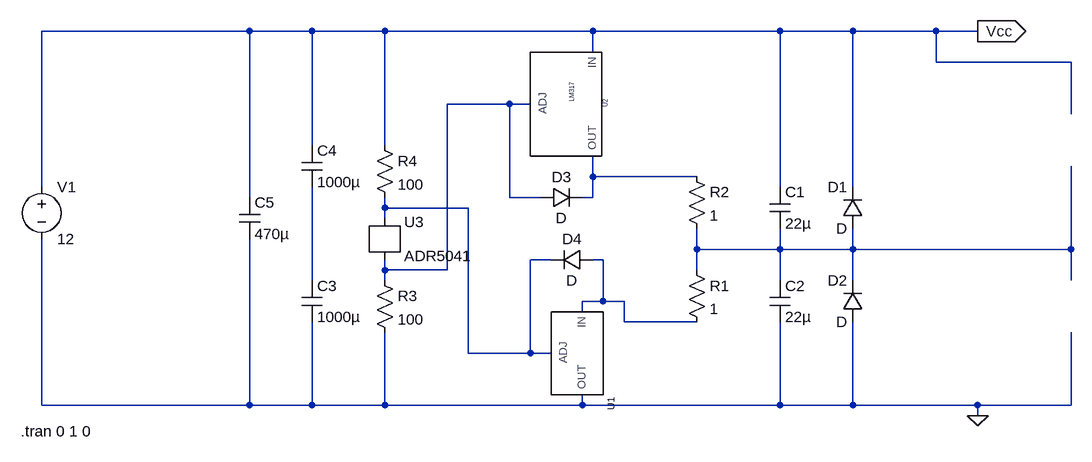
[diagram p0: schematic Draft1.asc]
Draft1.asc, the LTspice schematic file:
Version 4
SHEET 1 880 680
WIRE -1152 -192 -1472 -192
WIRE -1056 -192 -1152 -192
WIRE -944 -192 -1056 -192
WIRE -624 -192 -944 -192
WIRE -336 -192 -624 -192
WIRE -224 -192 -336 -192
WIRE -96 -192 -224 -192
WIRE -32 -192 -96 -192
WIRE -624 -160 -624 -192
WIRE -96 -144 -96 -192
WIRE 112 -144 -96 -144
WIRE -752 -80 -848 -80
WIRE -720 -80 -752 -80
WIRE 112 -64 112 -144
WIRE -1056 -16 -1056 -192
WIRE -944 -16 -944 -192
WIRE -624 32 -624 0
WIRE -464 32 -624 32
WIRE -1472 48 -1472 -192
WIRE -336 48 -336 -192
WIRE -224 48 -224 -192
WIRE -1152 64 -1152 -192
WIRE -752 64 -752 -80
WIRE -704 64 -752 64
WIRE -624 64 -624 32
WIRE -624 64 -640 64
WIRE -944 80 -944 64
WIRE -816 80 -944 80
WIRE -944 96 -944 80
WIRE -464 144 -464 112
WIRE -336 144 -336 112
WIRE -336 144 -464 144
WIRE -224 144 -224 112
WIRE -224 144 -336 144
WIRE 112 144 112 16
WIRE 112 144 -224 144
WIRE -688 160 -720 160
WIRE -608 160 -624 160
WIRE -944 176 -944 160
WIRE -848 176 -848 -80
WIRE -848 176 -944 176
WIRE -464 176 -464 144
WIRE -1056 192 -1056 48
WIRE -944 192 -944 176
WIRE -336 192 -336 144
WIRE -224 192 -224 144
WIRE 112 192 112 144
WIRE -608 224 -608 160
WIRE -608 224 -640 224
WIRE -576 224 -608 224
WIRE -640 240 -640 224
WIRE -576 256 -576 224
WIRE -464 256 -576 256
WIRE -816 304 -816 80
WIRE -720 304 -720 160
WIRE -720 304 -816 304
WIRE -688 304 -720 304
WIRE -1472 384 -1472 128
WIRE -1152 384 -1152 128
WIRE -1152 384 -1472 384
WIRE -1056 384 -1056 256
WIRE -1056 384 -1152 384
WIRE -944 384 -944 272
WIRE -944 384 -1056 384
WIRE -640 384 -640 368
WIRE -640 384 -944 384
WIRE -336 384 -336 256
WIRE -336 384 -640 384
WIRE -224 384 -224 256
WIRE -224 384 -336 384
WIRE -32 384 -224 384
WIRE 112 384 112 272
WIRE 112 384 -32 384
WIRE -32 400 -32 384
FLAG -32 400 0
FLAG -32 -192 Vcc
IOPIN -32 -192 Out
SYMBOL LM317 -656 -80 R90
SYMATTR InstName U2
SYMBOL LM337 -640 304 R90
SYMATTR InstName U1
SYMBOL res -480 160 R0
SYMATTR InstName R1
SYMATTR Value 1
SYMBOL res -480 16 R0
SYMATTR InstName R2
SYMATTR Value 1
SYMBOL res -960 176 R0
SYMATTR InstName R3
SYMATTR Value 100
SYMBOL res -960 -32 R0
SYMATTR InstName R4
SYMATTR Value 100
SYMBOL cap -352 48 R0
SYMATTR InstName C1
SYMATTR Value 22µ
SYMBOL cap -352 192 R0
SYMATTR InstName C2
SYMATTR Value 22µ
SYMBOL cap -1072 192 R0
SYMATTR InstName C3
SYMATTR Value 1000µ
SYMBOL cap -1072 -16 R0
SYMATTR InstName C4
SYMATTR Value 1000µ
SYMBOL References\\ADR5041 -944 128 R0
SYMATTR InstName U3
SYMBOL diode -208 112 R180
WINDOW 0 24 64 Left 2
WINDOW 3 24 0 Left 2
SYMATTR InstName D1
SYMBOL diode -208 256 R180
WINDOW 0 24 64 Left 2
WINDOW 3 24 0 Left 2
SYMATTR InstName D2
SYMBOL diode -704 80 R270
WINDOW 0 32 32 VTop 2
WINDOW 3 0 32 VBottom 2
SYMATTR InstName D3
SYMBOL diode -624 144 R90
WINDOW 0 0 32 VBottom 2
WINDOW 3 32 32 VTop 2
SYMATTR InstName D4
SYMBOL cap -1168 64 R0
SYMATTR InstName C5
SYMATTR Value 470µ
SYMBOL voltage -1472 32 R0
WINDOW 123 0 0 Left 0
WINDOW 39 0 0 Left 0
SYMATTR InstName V1
SYMATTR Value 12
TEXT -1504 424 Left 2 !.tran 0 1 0

The netlist it stands for:
* Draft1.asc
XU2 Vcc N001 N002 LM317  ; pins IN ADJ OUT
XU1 N005 N003 0 LM337  ; pins IN ADJ OUT
R1 N004 N005 1
R2 N002 N004 1
R3 N001 0 100
R4 Vcc N003 100
C1 Vcc N004 22µ
C2 N004 0 22µ
C3 N006 0 1000µ
C4 Vcc N006 1000µ
XU3 N003 N001 ADR5041
D1 N004 Vcc D
D2 0 N004 D
D3 N001 N002 D
D4 N005 N003 D
C5 Vcc 0 470µ
V1 Vcc 0 12
.model D D
.lib standard.dio
.tran 0 1 0
.lib LM317.sub
.lib LM337.sub
.lib ADR5041.sub
.backanno
.end